# EAGLE schematic dnc (EAGLE 7.1.0)
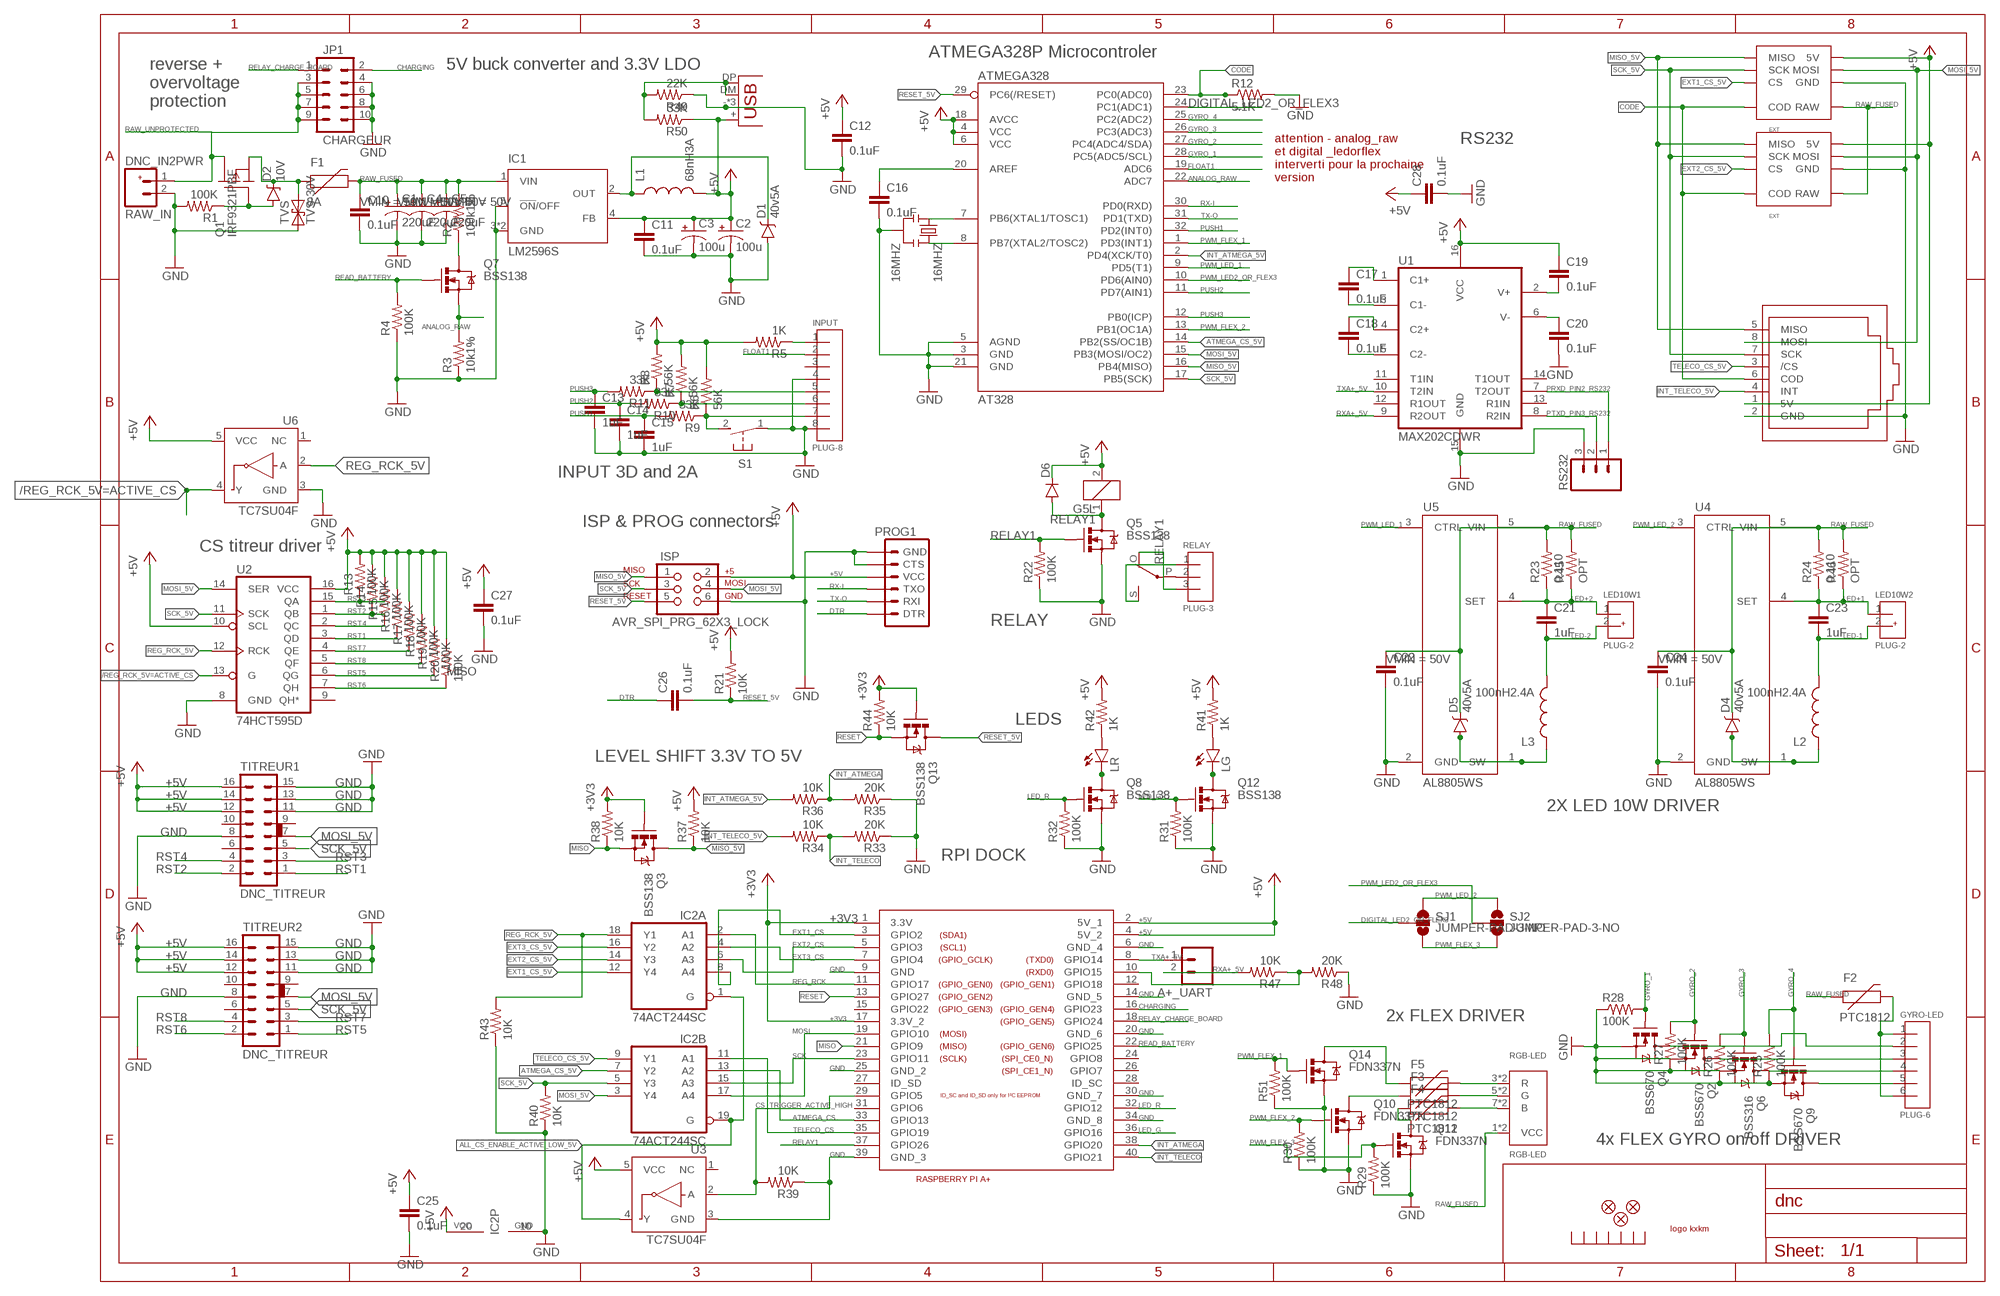
[diagram p0: schematic, sheet 1]

## Parts
16MHZ  16MHZ  RESONATOR16MHZ  [RESONATOR-SMD]
A+_UART  M02LOCK_LONGPADS  [1X02_LOCK_LONGPADS]
AT328  ATMEGA328  ATMEGA168  [TQFP32-08]
C1  220uF  CAP_POLE  [PANASONIC_E]
C2  100u  CPOL-USD  [PANASONIC_D]
C3  100u  CPOL-USD  [PANASONIC_D]
C4  220uF  CAP_POLE  [PANASONIC_E]
C5  220uF  CAP_POLE  [PANASONIC_E]
C10  0.1uF  C-EUC0603  [C0603]
C11  0.1uF  C-EUC0603  [C0603]
C12  0.1uF  C-EUC0603  [C0603]
C13  1uF  C-EUC0603  [C0603]
C14  1uF  C-EUC0603  [C0603]
C15  1uF  C-EUC0603  [C0603]
C16  0.1uF  C-EUC0603  [C0603]
C17  0.1uF  C-EUC0603  [C0603]
C18  0.1uF  C-EUC0603  [C0603]
C19  0.1uF  C-EUC0603  [C0603]
C20  0.1uF  C-EUC0603  [C0603]
C21  1uF  C-EUC0603  [C0603]
C22  0.1uF  C-EUC0603  [C0603]
C23  1uF  C-EUC0603  [C0603]
C24  0.1uF  C-EUC0603  [C0603]
C25  0.1uF  C-EUC0603  [C0603]
C26  0.1uF  C-EUC0603  [C0603]
C27  0.1uF  C-EUC0603  [C0603]
C28  0.1uF  C-EUC0603  [C0603]
D1  40v5A  DIODE_SCHOTKYSMPA  [DO-221]
D2  10V  DIODE-ZENERSOD-123  [SOD-123]
D4  40v5A  DIODE_SCHOTKYSMPA  [DO-221]
D5  40v5A  DIODE_SCHOTKYSMPA  [DO-221]
D6  DIODESMA-ALT  [SMA-DIODE_ALT]
EXT1  EXT  EXT-DNC  [EXTPINDNC]
EXT2  EXT  EXT-DNC  [EXTPINDNC]
F1  8A  PTCPTH  [PTC]
F2  PTC1812  [PTC_1812]
F3  PTC1812  [PTC_1812]
F4  PTC1812  [PTC_1812]
F5  PTC1812  [PTC_1812]
GYRO-LED  PLUG-6  M06  [PLUG_06]
IC1  LM2596S  [TO263-5]
IC2  74ACT244SC  74S244DW  [SO20W]
INPUT  PLUG-8  M08  [PLUG_08]
ISP  AVR_SPI_PRG_62X3_LOCK  [2X3_LOCK]
JP1  CHARGEUR  M05X2  [2X5_LOCK]
JP13  FIDUCIAL1X2.5  [FIDUCIAL-1X2.5]
JP14  FIDUCIAL1X2.5  [FIDUCIAL-1X2.5]
JP19  FIDUCIAL1X2.5  [FIDUCIAL-1X2.5]
L1  68nH3A  INDUCTORPWR  [CDRH125]
L2  100nH2.4A  INDUCTORPWR  [CDRH125]
L3  100nH2.4A  INDUCTORPWR  [CDRH125]
LED10W1  PLUG-2  M02PLUG  [PLUG_02]
LED10W2  PLUG-2  M02PLUG  [PLUG_02]
LG  LED1206  [LED-1206]
LR  LED1206  [LED-1206]
PROG1  ARDUINO_SERIAL_PROGRAMLOCK  [1X06_LOCK]
Q1  IRF9321PBF  [SO-8]
Q2  BSS670  MOSFET-NCHANNELBSS316  [SOT23-3]
Q3  BSS138  MOSFET-NCHANNELBSS138  [SOT23-3]
Q4  BSS670  MOSFET-NCHANNELBSS316  [SOT23-3]
Q5  BSS138  MOSFET-NCHANNELBSS138  [SOT23-3]
Q6  BSS316  MOSFET-NCHANNELBSS316  [SOT23-3]
Q7  BSS138  MOSFET-NCHANNELBSS138  [SOT23-3]
Q8  BSS138  MOSFET-NCHANNELBSS138  [SOT23-3]
Q9  BSS670  MOSFET-NCHANNELBSS316  [SOT23-3]
Q10  FDN337N  MOSFET-NCHANNELBSS316  [SOT23-3]
Q11  FDN337N  MOSFET-NCHANNELBSS316  [SOT23-3]
Q12  BSS138  MOSFET-NCHANNELBSS138  [SOT23-3]
Q13  BSS138  MOSFET-NCHANNELBSS138  [SOT23-3]
Q14  FDN337N  MOSFET-NCHANNELBSS316  [SOT23-3]
R1  100K  RESISTOR0603-RES  [0603-RES]
R2  100k1%  RESISTOR0603-RES  [0603-RES]
R3  10k1%  RESISTOR0603-RES  [0603-RES]
R4  100K  RESISTOR0603-RES  [0603-RES]
R5  1K  RESISTOR0603-RES  [0603-RES]
R6  56K  RESISTOR0603-RES  [0603-RES]
R7  56K  RESISTOR0603-RES  [0603-RES]
R8  56K  RESISTOR0603-RES  [0603-RES]
R9  33K  RESISTOR0603-RES  [0603-RES]
R10  33K  RESISTOR0603-RES  [0603-RES]
R11  33K  RESISTOR0603-RES  [0603-RES]
R12  5.1K  RESISTOR0603-RES  [0603-RES]
R13  100K  RESISTOR0603-RES  [0603-RES]
R14  100K  RESISTOR0603-RES  [0603-RES]
R15  100K  RESISTOR0603-RES  [0603-RES]
R16  100K  RESISTOR0603-RES  [0603-RES]
R17  100K  RESISTOR0603-RES  [0603-RES]
R18  100K  RESISTOR0603-RES  [0603-RES]
R19  100K  RESISTOR0603-RES  [0603-RES]
R20  100K  RESISTOR0603-RES  [0603-RES]
R21  10K  RESISTOR0603-RES  [0603-RES]
R22  100K  RESISTOR0603-RES  [0603-RES]
R23  0.110  R-US_R0805  [R0805]
R24  0.110  R-US_R0805  [R0805]
R25  100K  RESISTOR0603-RES  [0603-RES]
R26  100K  RESISTOR0603-RES  [0603-RES]
R27  100K  RESISTOR0603-RES  [0603-RES]
R28  100K  RESISTOR0603-RES  [0603-RES]
R29  100K  RESISTOR0603-RES  [0603-RES]
R30  100K  RESISTOR0603-RES  [0603-RES]
R31  100K  RESISTOR0603-RES  [0603-RES]
R32  100K  RESISTOR0603-RES  [0603-RES]
R33  20K  RESISTOR0603-RES  [0603-RES]
R34  10K  RESISTOR0603-RES  [0603-RES]
R35  20K  RESISTOR0603-RES  [0603-RES]
R36  10K  RESISTOR0603-RES  [0603-RES]
R37  10K  RESISTOR0603-RES  [0603-RES]
R38  10K  RESISTOR0603-RES  [0603-RES]
R39  10K  RESISTOR0603-RES  [0603-RES]
R40  10K  RESISTOR0603-RES  [0603-RES]
R41  1K  RESISTOR0603-RES  [0603-RES]
R42  1K  RESISTOR0603-RES  [0603-RES]
R43  10K  RESISTOR0603-RES  [0603-RES]
R44  10K  RESISTOR0603-RES  [0603-RES]
R45  OPT  R-US_R0805  [R0805]
R46  OPT  R-US_R0805  [R0805]
R47  10K  RESISTOR0603-RES  [0603-RES]
R48  20K  RESISTOR0603-RES  [0603-RES]
R49  22K  RESISTOR0603-RES  [0603-RES]
R50  33K  RESISTOR0603-RES  [0603-RES]
R51  100K  RESISTOR0603-RES  [0603-RES]
RAW_IN  DNC_IN2PWR  [DNC_IN2_PWR]
RELAY  PLUG-3  M03  [PLUG_03]
RELAY1  G5L  [G5LE]
RGB-LED  RJ45-RGBLED  [RJ45-TRAFO]
RS232  M03LOCK  [1X03_LOCK]
S1  31-XX  [B3F-31XX]
SJ1  JUMPER-PAD-3-NO  [PAD-JUMPER-3-NO_YES_SILK_FULL_BOX_WIDE_SPACING]
SJ2  JUMPER-PAD-3-NO  [PAD-JUMPER-3-NO_YES_SILK_FULL_BOX_WIDE_SPACING]
TITREUR1  DNC_TITREUR  [DNC_TITREUR]
TITREUR2  DNC_TITREUR  [DNC_TITREUR]
TVS  TVS-30V  TVS  [SMA-DIODE]
U1  MAX202CDWR  MAX232SOIC16  [SO016]
U2  74HCT595D  [SO16]
U3  TC7SU04F  INVERTER_SOT23-5  [SOT23-5]
U4  AL8805WS  AL8805  [SOT23-5]
U5  AL8805WS  AL8805  [SOT23-5]
U6  TC7SU04F  INVERTER_SOT23-5  [SOT23-5]
U$1  RADIATEUR  [RADIATEUR_577102B00000G]
U$2  LOGOSIZE2  [KXKMLOGO2]
U$4  RASPIA+  [RASPIA+]
U$8  RJ45-EXTDNC  [RJ45-TRAFO]
X1  USB  [USB_F_SATISTRONIC]

## Nets
+3V3 [3.3V]: Q3.1(G) Q13.1(G) R38.2 R44.2 U$4.1(3.3V) U$4.17(3.3V_2)
+5V [5V]: AT328.4(VCC) AT328.6(VCC) AT328.18(AVCC) C2.+ C3.+ C11.1 C12.1 C19.1 C25.1 C27.1 C28.1 D6.C EXT1.5V EXT2.5V IC1.4(FB) IC2.20(P:VCC) ISP.2 L1.2 PROG1.4(VCC) R5.2 R6.2 R7.2 R8.2 R13.2 R14.2 R15.2 R16.2 R17.2 R18.2 R19.2 R20.2 R21.2 R37.2 R41.2 R42.2 R50.1 RELAY1.2 TITREUR1.12 TITREUR1.14 TITREUR1.16 TITREUR2.12 TITREUR2.14 TITREUR2.16 U1.16(VCC) U2.10(SCL) U2.16(VCC) U3.5(VCC) U6.5(VCC) U$4.2(5V_1) U$4.4(5V_2) U$8.1(5V) X1.+(V+)
/REG_RCK_5V=ACTIVE_CS: U2.13(G) U6.4(Y)
ALL_CS_ENABLE_ACTIVE_LOW_5V: IC2.1(A:G) IC2.19(B:G) U3.4(Y)
ANALOG_RAW: AT328.22(ADC7) Q7.2(S) R3.2
AREF: AT328.20(AREF) C16.1
ATMEGA_CS: IC2.13(B:A2) U$4.33(GPIO13)
ATMEGA_CS_5V: AT328.14(PB2(SS/OC1B)) IC2.7(B:Y2)
BB: F4.2 RGB-LED.7(B) RGB-LED.8(B)
CHARGING: JP1.2 U$4.16(GPIO23)
CODE: AT328.23(PC0(ADC0)) EXT1.RETOURANALOG(COD) EXT2.RETOURANALOG(COD) R12.1 U$8.6(COD)
CS_TRIGGER_ACTIVE_HIGH: R39.2 U3.2(A) U$4.29(GPIO5)
DIGITAL_LED2_OR_FLEX3: AT328.24(PC1(ADC1)) SJ1.2
DTR: C26.1 PROG1.1(DTR)
EXT1_CS: IC2.8(A:A4) U$4.3(GPIO2)
EXT1_CS_5V: EXT1./CS(CS) IC2.12(A:Y4)
EXT2_CS: IC2.6(A:A3) U$4.5(GPIO3)
EXT2_CS_5V: EXT2./CS(CS) IC2.14(A:Y3)
EXT3_CS: IC2.4(A:A2) U$4.7(GPIO4)
EXT3_CS_5V: IC2.16(A:Y2)
FLOAT1: AT328.19(ADC6) INPUT.2
GG: F3.2 RGB-LED.5(G) RGB-LED.6(G)
GND [GND]: 16MHZ.2 AT328.3(GND) AT328.5(AGND) AT328.21(GND) C1.- C2.- C3.- C4.- C5.- C10.2 C11.2 C12.2 C13.2 C14.2 C15.2 C16.2 C20.2 C22.2 C24.2 C25.2 C27.2 C28.2 D1.A EXT1.1_GND(GND) EXT1.GND2(GND) EXT2.1_GND(GND) EXT2.GND2(GND) IC1.3(GND) IC1.5(!ON!/OFF) IC1.THERMAL(GND) IC2.10(P:GND) INPUT.4 INPUT.8 ISP.6 JP1.4 JP1.6 JP1.8 JP1.10 PROG1.5(CTS) PROG1.6(GND) Q2.2(S) Q4.2(S) Q5.2(S) Q6.2(S) Q8.2(S) Q9.2(S) Q10.2(S) Q11.2(S) Q12.2(S) Q14.2(S) R1.2 R3.1 R4.1 R12.2 R22.1 R25.1 R26.1 R27.1 R28.1 R29.1 R30.1 R31.1 R32.1 R33.1 R35.1 R39.1 R40.1 R43.1 R48.1 R49.1 R51.1 RAW_IN.2(-) RS232.3 S1.1(P) TITREUR1.8 TITREUR1.11 TITREUR1.13 TITREUR1.15 TITREUR2.8 TITREUR2.11 TITREUR2.13 TITREUR2.15 TVS.A U1.15(GND) U2.8(GND) U3.3(GND) U4.2(GND) U5.2(GND) U6.3(GND) U$4.6(GND_4) U$4.9(GND) U$4.14(GND_5) U$4.20(GND_6) U$4.25(GND_2) U$4.30(GND_7) U$4.34(GND_8) U$4.39(GND_3) U$8.2(GND) X1.-(GND) X1.S1(GND) X1.S2(GND)
GYRO_1: AT328.28(PC5(ADC5/SCL)) Q4.1(G) R28.2
GYRO_2: AT328.27(PC4(ADC4/SDA)) Q2.1(G) R27.2
GYRO_3: AT328.26(PC3(ADC3)) Q6.1(G) R26.2
GYRO_4 [5V]: AT328.25(PC2(ADC2)) Q9.1(G) R25.2
INT_ATMEGA: R35.2 R36.1 U$4.38(GPIO20)
INT_ATMEGA_5V: AT328.2(PD4(XCK/T0)) R36.2
INT_TELECO: R33.2 R34.1 U$4.40(GPIO21)
INT_TELECO_5V: R34.2 U$8.4(INT)
LED+1 [5V]: C23.1 LED10W2.1 R24.1 R46.1 U4.4(SET)
LED+2 [5V]: C21.1 LED10W1.1 R23.1 R45.1 U5.4(SET)
LED-1 [5V]: C23.2 L2.2 LED10W2.2
LED-2 [5V]: C21.2 L3.2 LED10W1.2
LED_G: Q12.1(G) R31.2 U$4.36(GPIO16)
LED_R: Q8.1(G) R32.2 U$4.32(GPIO12)
LEDR: LR.C Q8.3(D)
LG: LG.C Q12.3(D)
MISO: Q3.2(S) R38.1 U$4.21(GPIO9)
MISO_5V: AT328.16(PB4(MISO)) EXT1.MISO EXT2.MISO ISP.1 Q3.3(D) R37.1 U$8.5(MISO)
MOSI: IC2.17(B:A4) U$4.19(GPIO10)
MOSI_5V: AT328.15(PB3(MOSI/OC2)) EXT1.MOSI EXT2.MOSI IC2.3(B:Y4) ISP.4 TITREUR1.7 TITREUR2.7 U2.14(SER) U$8.8(MOSI)
N$1 [5V]: D1.C IC1.2(OUT) L1.1
N$3: Q7.3(D) R2.1
N$5: F2.2 GYRO-LED.1 GYRO-LED.6
N$6: D4.A L2.1 U4.1(SW)
N$7: D5.A L3.1 U5.1(SW)
N$8 [230AC]: RELAY1.P(2:P) RELAY.2
N$10: GYRO-LED.2 Q4.3(D)
N$11: GYRO-LED.3 Q2.3(D)
N$12: GYRO-LED.4 Q6.3(D)
N$13: GYRO-LED.5 Q9.3(D)
N$16: D6.A Q5.3(D) RELAY1.1
N$17: F4.1 Q11.3(D)
N$18: LG.A R41.1
N$19: F3.1 Q10.3(D)
N$21: LR.A R42.1
N$24: C19.2 U1.2(V+)
N$25: INPUT.1 R5.1
N$26: R49.2 R50.2 X1.DM(D-) X1.DP(D+)
N$30: F5.1 Q14.3(D)
N$35: C20.1 U1.6(V-)
N$43: 16MHZ.1 AT328.7(PB6(XTAL1/TOSC1))
N$44: 16MHZ.3 AT328.8(PB7(XTAL2/TOSC2))
N$50: C18.2 U1.5(C2-)
N$51: C18.1 U1.4(C2+)
N$52: C17.2 U1.3(C1-)
N$53: C17.1 U1.1(C1+)
PROTECT_GATE: D2.A Q1.4(G) R1.1
PRXD_PIN2_RS232: RS232.1 U1.7(T2OUT)
PTXD_PIN3_RS232: RS232.2 U1.8(R2IN)
PUSH1: AT328.32(PD2(INT0)) C15.1 R9.2
PUSH2: AT328.11(PD7(AIN1)) C14.1 R10.2
PUSH3: AT328.12(PB0(ICP)) C13.1 R11.2
PWM_FLEX_1: AT328.1(PD3(INT1)) Q14.1(G) R51.2
PWM_FLEX_2: AT328.13(PB1(OC1A)) Q10.1(G) R30.2
PWM_FLEX_3: Q11.1(G) R29.2 SJ1.3 SJ2.3
PWM_LED2_OR_FLEX3: AT328.10(PD6(AIN0)) SJ2.2
PWM_LED_1: AT328.9(PD5(T1)) U5.3(CTRL)
PWM_LED_2: SJ1.1 SJ2.1 U4.3(CTRL)
RAW_FUSED [5V]: C1.+ C4.+ C5.+ C10.1 C22.1 C24.1 D4.C D5.C EXT1.RAW EXT1.RAW2(RAW) EXT2.RAW EXT2.RAW2(RAW) F1.P$2 F2.1 IC1.1(VIN) R2.2 R23.2 R24.2 R45.2 R46.2 RGB-LED.1(VCC) RGB-LED.2(VCC) U4.5(VIN) U5.5(VIN)
RAW_POL_PROTECTED [5V]: D2.C F1.P$1MOV Q1.1(S) Q1.2(S) Q1.3(S) TVS.C
RAW_UNPROTECTED [5V]: JP1.3 JP1.5 JP1.7 JP1.9 Q1.5(D) Q1.6(D) Q1.7(D) Q1.8(D) RAW_IN.1(+)
READ_BATTERY: Q7.1(G) R4.2 U$4.22(GPIO25)
REG_RCK: IC2.2(A:A1) U$4.11(GPIO17)
REG_RCK_5V: IC2.18(A:Y1) R43.2 U2.12(RCK) U6.2(A)
RELAY1: Q5.1(G) R22.2 U$4.37(GPIO26)
RELAY_CHARGE_BOARD: JP1.1 U$4.18(GPIO24)
RESET: Q13.2(S) R44.1 U$4.13(GPIO27)
RESET_5V: AT328.29(PC6(/RESET)) C26.2 ISP.5 Q13.3(D) R21.1
RNC [230AC]: RELAY1.O(2:O) RELAY.3
RNO [230AC]: RELAY1.S(2:S) RELAY.1
RR: F5.2 RGB-LED.3(R) RGB-LED.4(R)
RST1: R16.1 TITREUR1.1 U2.3(QD)
RST2: R14.1 TITREUR1.2 U2.1(QB)
RST3: R13.1 TITREUR1.3 U2.15(QA)
RST4: R15.1 TITREUR1.4 U2.2(QC)
RST5: R19.1 TITREUR2.1 U2.6(QG)
RST6: R20.1 TITREUR2.2 U2.7(QH)
RST7: R17.1 TITREUR2.3 U2.4(QE)
RST8: R18.1 TITREUR2.4 U2.5(QF)
RX-I: AT328.30(PD0(RXD)) PROG1.3(TXO)
RXA+: R47.1 R48.2 U$4.10(GPIO15)
RXA+_5V: A+_UART.2 R47.2 U1.9(R2OUT)
S1: INPUT.7 R6.1 R9.1 S1.2(S)
S2: INPUT.6 R7.1 R10.1
S3: INPUT.5 R8.1 R11.1
SCK: IC2.15(B:A3) U$4.23(GPIO11)
SCK_5V: AT328.17(PB5(SCK)) EXT1.SCK EXT2.SCK IC2.5(B:Y3) ISP.3 R40.2 TITREUR1.5 TITREUR2.5 U2.11(SCK) U$8.7(SCK)
TELECO_CS: IC2.11(B:A1) U$4.35(GPIO19)
TELECO_CS_5V: IC2.9(B:Y1) U$8.3(/CS)
TX-O: AT328.31(PD1(TXD)) PROG1.2(RXI)
TXA+_5V: A+_UART.1 U1.10(T2IN) U$4.8(GPIO14)
Unconnected: INPUT.3 TITREUR1.6 TITREUR1.9 TITREUR1.10 TITREUR2.6 TITREUR2.9 TITREUR2.10 U1.11(T1IN) U1.12(R1OUT) U1.13(R1IN) U1.14(T1OUT) U2.9(QH*) U3.1(NC) U6.1(NC) U$4.12(GPIO18) U$4.15(GPIO22) U$4.24(GPIO8) U$4.26(GPIO7) U$4.27(ID_SD) U$4.28(ID_SC) U$4.31(GPIO6)

## Notes on the sheet
- ATMEGA328P Microcontroler
- 5V buck converter and 3.3V LDO
- reverse + 
  overvoltage 
  protection
- RS232
- attention - analog_raw 
  et digital _ledorflex 
  interverti pour la prochaine 
  version
- INPUT 3D and 2A
- ISP & PROG connectors
- CS titreur driver
- RELAY
- LEDS
- LEVEL SHIFT 3.3V TO 5V
- 2X LED 10W DRIVER
- RPI DOCK
- 2x FLEX DRIVER
- 4x FLEX GYRO on/off DRIVER

## Library data of the parts
16MHZ = SparkFun-FreqCtrl:RESONATOR: Resonator Small SMD resonator. Used, eg, on the Arduino Pro/ Pro Mini boards. 8MHz- XTAL-08895 16MHz- XTAL-08900; OC_FARNELL: 2101363; PROD_ID: XTAL-08900
A+_UART = SparkFun:M02: Header 2 Standard 2-pin 0.1" header. Use with straight break away headers (SKU : PRT-00116), right angle break away headers (PRT-00553), swiss pins (PRT-00743), machine pins (PRT-00117), and female headers (PRT-00115). Molex polarized connector foot print use with SKU : PRT-08233 with associated crimp pins and housings.; MOUNT: NO
AT328 = SparkFun:ATMEGA168; OC_FARNELL: 2443176
C1 C4 C5 = SparkFun:CAP_POL: Capacitor Polarized These are standard SMD and PTH capacitors. Normally 10uF, 47uF, and 100uF in electrolytic and tantalum varieties. Always verify the external diameter of the through hole cap, it varies with capacity, voltage, and manufacturer. The EIA devices should be standard.; OC_FARNELL: 1800687; VMIN: 50V
C2 C3 = rcl:CPOL-US: POLARIZED CAPACITOR, American symbol; OC_FARNELL: 2326175RL
C10 C22 C24 = rcl:C-EU: CAPACITOR, European symbol; VMIN: 50V
C11-C21 C23 C25-C28 = rcl:C-EU: CAPACITOR, European symbol
D1 D4 D5 = pierre_vv:DIODE_SCHOTKY; OC_FARNELL: 1861427
D2 = SparkFun-DiscreteSemi:DIODE-ZENER: Zener Diode Production Part - 8199 3.4V Zener Voltage; OC_FARNELL: 1431256
D6 = SparkFun-DiscreteSemi:DIODE: Diode These are standard reverse protection diodes and small signal diodes. SMA package can handle up to about 1A. SOD-323 can handle about 200mA. What the SOD-323 package when ordering, there are some mfgs out there that are 5-pin packages.; OC_FARNELL: 2101190
EXT1 EXT2 = pierre_vv:EXT-DNC; MOUNT: NO
F1 = SparkFun:PTC: Resettable Fuse PTC Resettable Fuse. Spark Fun Electronics SKU : COM-08357; MOUNT: NO; OC_FARNELL: 1861144
F2-F5 = pierre_vv:PTC
GYRO-LED = pierre_vv:M06; MOUNT: NO
IC1 = national-semiconductor:LM2596: SIMPLE SWITCHER® Power Converter 150 kHz 3A Step-Down Voltage Regulator Source: http://www.national.com/ds/LM/LM2596.pdf; MF: NATIONAL SEMICONDUCTOR; MPN: LM2596S-ADJ/NOPB; OC_FARNELL: 1469194; OC_NEWARK: 41K3842
IC2 = 74xx-us:74*244: Octal BUFFER and LINE DRIVER, 3-state; OC_FARNELL: 1014150
INPUT = pierre_vv:M08; MOUNT: NO
ISP = SparkFun:AVR_SPI_PRG_6: AVR ISP 6 Pin This is the reduced ISP connector for AVR programming. Common on Arduino. This footprint will take up less PCB space and can be used with a 10-pin to 6-pin adapter such as SKU: BOB-08508; MOUNT: NO
JP1 = pierre_vv:M05X2; MOUNT: NO
JP13 JP14 JP19 = SparkFun:FIDUCIAL: Fiducial Alignment Points Various fiducial points for machine vision alignment.; MOUNT: NO
L1 = SparkFun:INDUCTOR: Inductors Basic Inductor/Choke - 0603 and 1206. Footprints are not proven and vary greatly between part numbers.; OC_FARNELL: 2288510
L2 L3 = SparkFun:INDUCTOR: Inductors Basic Inductor/Choke - 0603 and 1206. Footprints are not proven and vary greatly between part numbers.; OC_FARNELL: 1864459RL
LED10W1 LED10W2 = pierre_vv:M02; MOUNT: NO
LG = SparkFun-LED:LED: LEDs Standard schematic elements and footprints for 5mm, 3mm, 1206, and 0603 sized LEDs. 5mm - Spark Fun Electronics SKU : COM-00529 (and others); OC_FARNELL: 2426223
LR = SparkFun-LED:LED: LEDs Standard schematic elements and footprints for 5mm, 3mm, 1206, and 0603 sized LEDs. 5mm - Spark Fun Electronics SKU : COM-00529 (and others); OC_FARNELL: 2426229
PROG1 = SparkFun:ARDUINO_SERIAL_PROGRAM; MOUNT: NO
Q1 = pierre_vv:IRF9321PBF; OC_FARNELL: 1831075
Q2 Q4 Q6 Q9 = SparkFun-DiscreteSemi:MOSFET-NCHANNEL: Common NMOSFET Parts MFG P/N Store ID Prod ID FDD8780 TRANS-09984 SI7820DN TRANS-11055 FDS6630A IC-08089 2N7002PW TRANS-11151 FQP30N06L COM-10213 TRANS-10060 BSS123LT1G TRANS-08345 BSS138 TRANS-00830 BS170 2N7000; OC_FARNELL: 2432720
Q3 Q5 Q7 Q8 Q12 Q13 = SparkFun-DiscreteSemi:MOSFET-NCHANNEL: Common NMOSFET Parts MFG P/N Store ID Prod ID FDD8780 TRANS-09984 SI7820DN TRANS-11055 FDS6630A IC-08089 2N7002PW TRANS-11151 FQP30N06L COM-10213 TRANS-10060 BSS123LT1G TRANS-08345 BSS138 TRANS-00830 BS170 2N7000; OC_FARNELL: 2053833; PROD_ID: TRANS-00830
Q10 Q11 Q14 = SparkFun-DiscreteSemi:MOSFET-NCHANNEL: Common NMOSFET Parts MFG P/N Store ID Prod ID FDD8780 TRANS-09984 SI7820DN TRANS-11055 FDS6630A IC-08089 2N7002PW TRANS-11151 FQP30N06L COM-10213 TRANS-10060 BSS123LT1G TRANS-08345 BSS138 TRANS-00830 BS170 2N7000; OC_FARNELL: 1864577
R1-R22 R25-R44 R47-R51 = SparkFun-Passives:RESISTOR: Resistor Basic schematic elements and footprints for 0603, 1206, and PTH resistors.
R23 R24 = rcl:R-US_: RESISTOR, American symbol
R45 R46 = rcl:R-US_: RESISTOR, American symbol; MOUNT: NO
RAW_IN = pierre_vv:DNC_IN2; MOUNT: NO
RELAY = pierre_vv:M03; MOUNT: NO
RELAY1 = relay:G5L: RELAY 1 x switch, 10 A/120 V AC, 8 A/30 V ADC, Omron; MOUNT: NO; OC_FARNELL: 2213788; OC_NEWARK: unknown
RGB-LED = con-amphenol-rj45-ld:RJ45-RGBLED; MOUNT: NO; OC_FARNELL: 1849917
RS232 = SparkFun-Connectors:M03: Header 3 Standard 3-pin 0.1" header. Use with straight break away headers (SKU : PRT-00116), right angle break away headers (PRT-00553), swiss pins (PRT-00743), machine pins (PRT-00117), and female headers (PRT-00115). Molex polarized connector foot print use with SKU : PRT-08232 with associated crimp pins and housings.; MOUNT: NO
S1 = switch-omron:31-XX: OMRON SWITCH; MPN: B3F-3100; OC_FARNELL: 2079502; OC_NEWARK: 36M3582
SJ1 SJ2 = SparkFun-Passives:JUMPER-PAD-3-NO
TITREUR1 TITREUR2 = pierre_vv:DNC_TITREUR; MOUNT: NO
TVS = SparkFun:TVS; OC_FARNELL: 9802819RL
U1 = SparkFun-DigitalIC:MAX232: RS232 Transceiver Very common IC. This is generically called 'MAX232', but works with the 3V equivalent MAX3232 generic ICs. Field tested and mother approved. Spark Fun Electronics SKU : COM-00316 (DIP) and COM-00589 (SMD); OC_FARNELL: 2382871
U2 = IC:74*595: 8-bit SHIFT REGISTER, output latch; OC_FARNELL: 2445164
U3 U6 = SparkFun-DigitalIC:INVERTER: Single inverter, SOT23-5; NOTE: RETIRED; OC_FARNELL: 1105925; PROD_ID: 8211
U4 U5 = SparkFun-PowerIC:AL8805: Constant current LED driver PWM-able 1MHz switch freq 6V-36V Up to 1A LED current; OC_FARNELL: 2138313; PROD_ID: IC-11626
U$1 = pierre_vv:RADIATEUR; MOUNT: NO; OC_FARNELL: 1703172
U$2 = pierre_vv:LOGO; MOUNT: NO
U$4 = pierre_vv:RASPIA+; MOUNT: NO
U$8 = con-amphenol-rj45-ld:RJ45-EXTDNC: dnc; MOUNT: NO; OC_FARNELL: 1849917
X1 = pierre_vv:USB; MOUNT: NO

## Net classes
0 default: width 0.203 mm
1 GND: width 0.254 mm
2 3.3V: width 0.203 mm
3 5V: width 0.305 mm
4 230AC: width 0.61 mm, clearance 0.305 mm